# EAGLE design harp expander servo driver v1.1 (EAGLE 9.6.2)
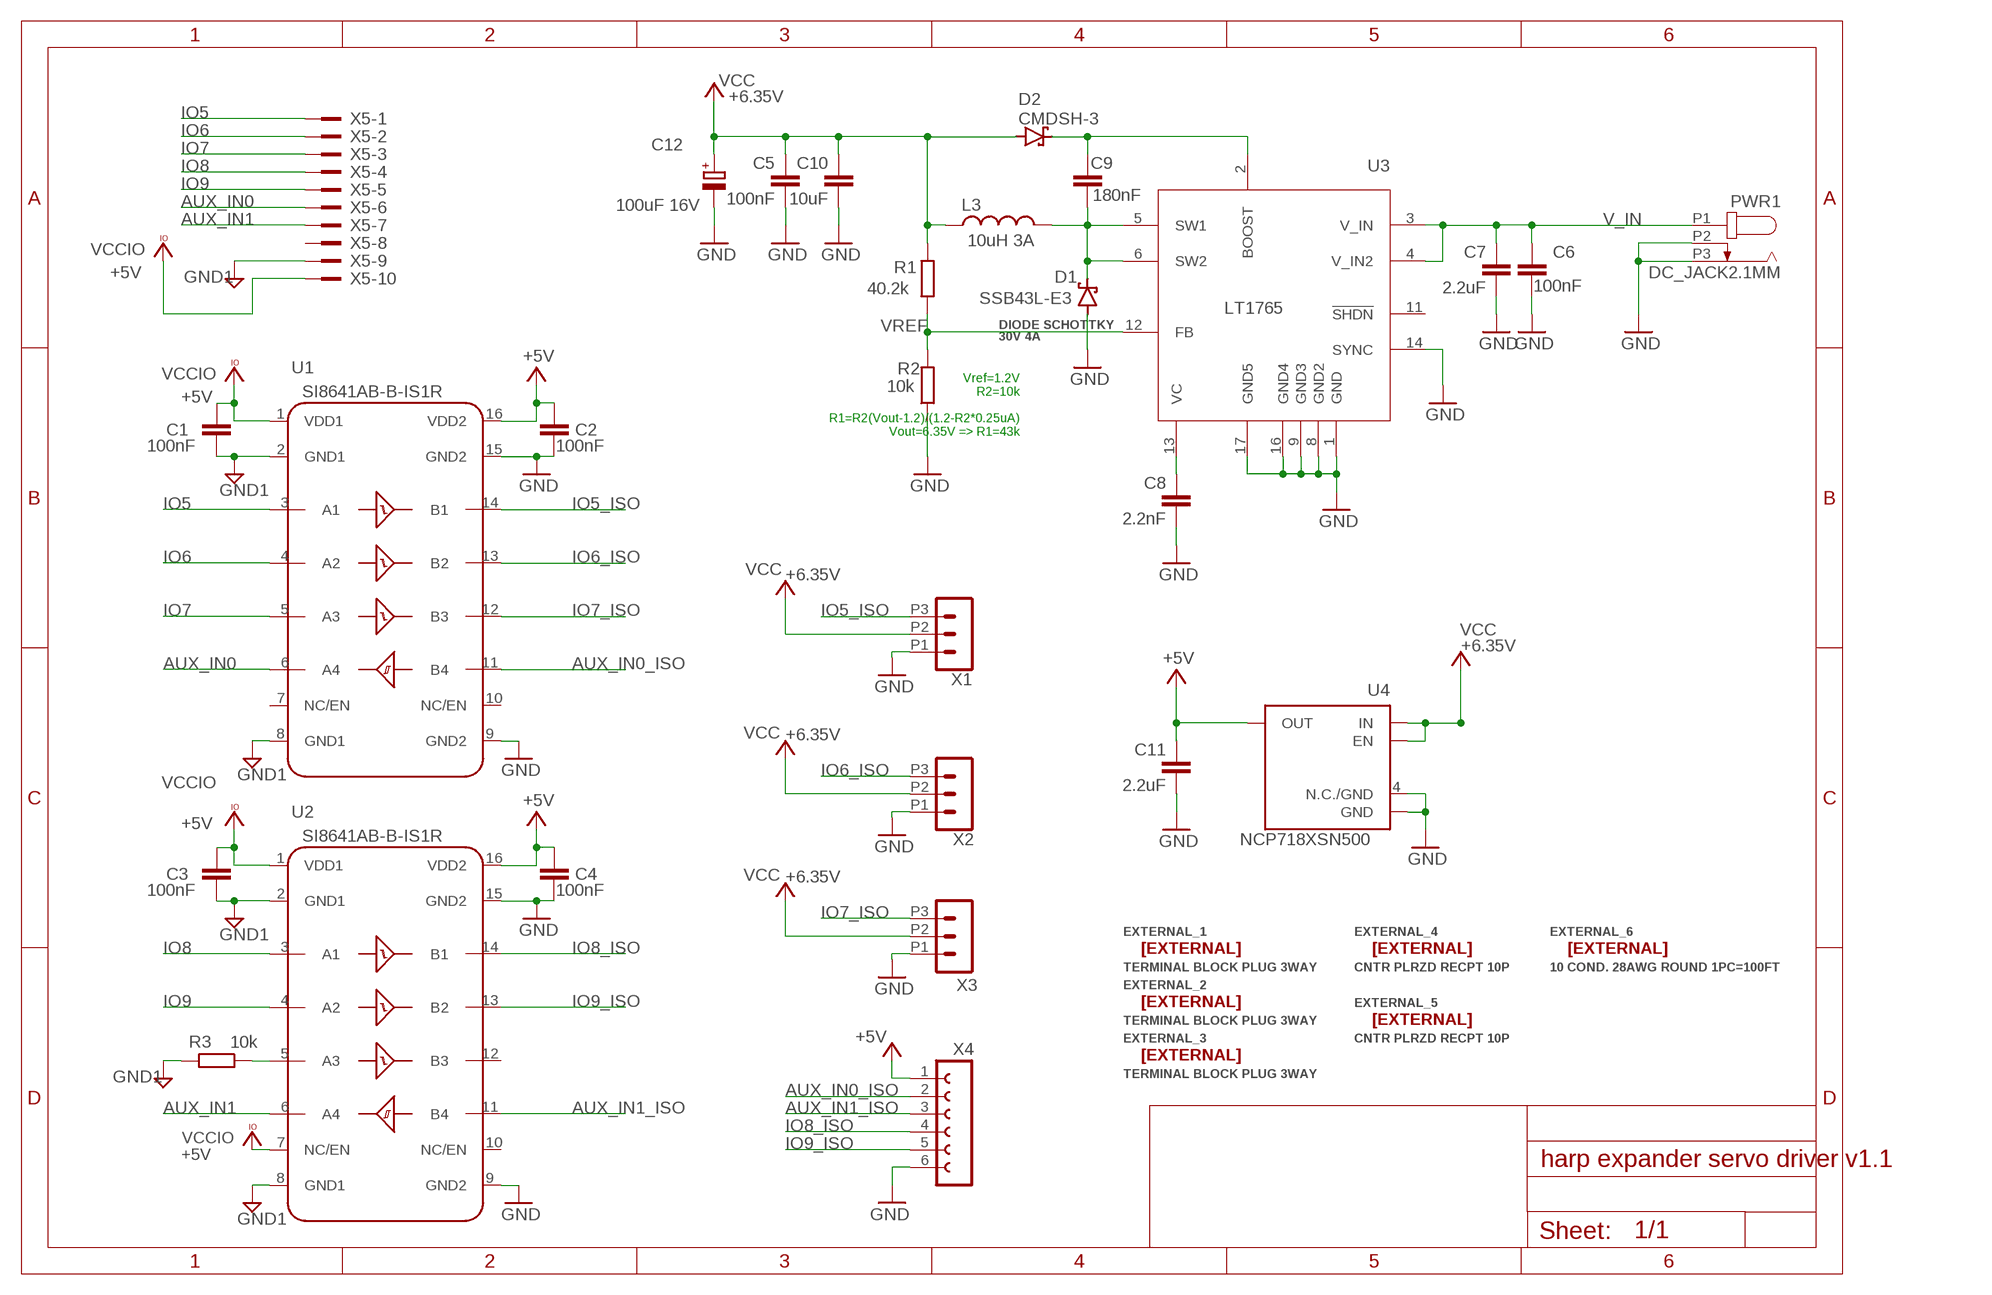
[diagram p0: schematic, sheet 1]

## Parts
C1  100nF  C-EUC0402  [C0402]
C2  100nF  C-EUC0402  [C0402]
C3  100nF  C-EUC0402  [C0402]
C4  100nF  C-EUC0402  [C0402]
C5  100nF  C-EUC0402  [C0402]
C6  100nF  C-EUC0402  [C0402]
C7  2.2uF  C-EUC0603  [C0603]
C8  2.2nF  C-EUC0402  [C0402]
C9  180nF  C-EUC0603  [C0603]
C10  10uF  C-EUC0603  [C0603]
C11  2.2uF  C-EUC0603  [C0603]
C12  100uF 16V  CPOL-EUCT7343  [CT7343]
D1  SSB43L-E3  MBRS130LT3  [SMB]
D2  CMDSH-3  SCHOTTKY-DIODESOD323  [SOD323-R]
EXTERNAL_1  TERMINAL BLOCK PLUG 3WAY  EXTERNAL  [-]
EXTERNAL_2  TERMINAL BLOCK PLUG 3WAY  EXTERNAL  [-]
EXTERNAL_3  TERMINAL BLOCK PLUG 3WAY  EXTERNAL  [-]
EXTERNAL_4  CNTR PLRZD RECPT 10P  EXTERNAL  [-]
EXTERNAL_5  CNTR PLRZD RECPT 10P  EXTERNAL  [-]
EXTERNAL_6  10 COND. 28AWG ROUND 1PC=100FT  EXTERNAL  [-]
L3  10uH 3A  L_IHLP2525CZER100M01  [L_IHLP_PADS]
PWR1  DC_JACK2.1MM  [DC_POWER_INPUT_2.1MM]
R1  40.2k  R-EU_R0402  [R0402]
R2  10k  R-EU_R0402  [R0402]
R3  10k  R-EU_R0402  [R0402]
U1  SI8641AB-B-IS1R  SI8641ABW  [SO16W]
U2  SI8641AB-B-IS1R  SI8641ABW  [SO16W]
U3  LT1765  [TSSOP16]
U4  NCP718XSN500  [SOT23-5]
X1  CON_3.5MM_1X3  [CON_3.5MM_1X3]
X2  CON_3.5MM_1X3  [CON_3.5MM_1X3]
X3  CON_3.5MM_1X3  [CON_3.5MM_1X3]
X4  aux_header  FE06-1  [FE06]
X5  IDC 10WAY STRAIGHT  2510-  [PAK100/2500-10]

## Nets
+5V: C2.1 C4.1 C11.1 U1.16(VDD2) U2.16(VDD2) U4.5(OUT) X4.1
AUX_IN0: U1.6(A4) X5.6
AUX_IN0_ISO: U1.11(B4) X4.2
AUX_IN1: U2.6(A4) X5.7
AUX_IN1_ISO: U2.11(B4) X4.3
GND: C2.2 C4.2 C5.2 C6.2 C7.2 C8.2 C10.2 C11.2 C12.- D1.A PWR1.P2 PWR1.P3 R2.1 U1.9(GND2) U1.15(GND2) U2.9(GND2) U2.15(GND2) U3.1(GND) U3.8(GND2) U3.9(GND3) U3.14(SYNC) U3.16(GND4) U3.17(GND5) U4.2(GND) U4.4(N.C./GND) X1.P1 X2.P1 X3.P1 X4.6
GND1: C1.2 C3.2 R3.2 U1.2(GND1) U1.8(GND1) U2.2(GND1) U2.8(GND1) X5.9
IO5: U1.3(A1) X5.1
IO5_ISO: U1.14(B1) X1.P3
IO6: U1.4(A2) X5.2
IO6_ISO: U1.13(B2) X2.P3
IO7: U1.5(A3) X5.3
IO7_ISO: U1.12(B3) X3.P3
IO8: U2.3(A1) X5.4
IO8_ISO: U2.14(B1) X4.4
IO9: U2.4(A2) X5.5
IO9_ISO: U2.13(B2) X4.5
N$9: R3.1 U2.5(A3)
N$10: C8.1 U3.13(VC)
N$17: C9.2 D1.C L3.2 U3.5(SW1) U3.6(SW2)
N$19: C9.1 D2.C U3.2(BOOST)
V_IN: C6.1 C7.1 PWR1.P1 U3.3(V_IN) U3.4(V_IN2)
VCC: C5.1 C10.1 C12.+ D2.A L3.1 R1.2 U4.1(IN) U4.3(EN) X1.P2 X2.P2 X3.P2
VCCIO: C1.1 C3.1 U1.1(VDD1) U2.1(VDD1) U2.7(NC/EN) X5.10
VREF: R1.1 R2.2 U3.12(FB)
Unconnected: U1.7(NC/EN) U1.10(NC/EN) U2.10(NC/EN) U2.12(B3) U3.7(NC7) U3.10(NC10) U3.11(!SHDN) U3.15(NC15) X5.8

## Notes on the sheet
- DIODE SCHOTTKY 
  30V 4A
- Vref=1.2V
  R2=10k
  
  R1=R2(Vout-1.2)/(1.2-R2*0.25uA)
  Vout=6.35V => R1=43k

## Library data of the parts
C1-C6 = rcl:C-EU: CAPACITOR, European symbol; DIGIKEY_PN: 445-6899-2-ND; MPN: CGA2B3X7R1H104K050BB; TYPE: SMD
C7 C11 = rcl:C-EU: CAPACITOR, European symbol; DIGIKEY_PN: 490-12738-1-ND; MPN: GRM188R61E225MA12D; TYPE: SMD
C8 = rcl:C-EU: CAPACITOR, European symbol; DIGIKEY_PN: 1276-1532-6-ND; MPN: CL05B222JB5NNNC; TYPE: SMD
C9 = rcl:C-EU: CAPACITOR, European symbol; DIGIKEY_PN: 490-GCG188R91H184KA01DCT-ND; MPN: GCG188R91H184KA01D; TYPE: SMD
C10 = rcl:C-EU: CAPACITOR, European symbol; DIGIKEY_PN: 587-3238-1-ND; MPN: EMK107BBJ106MA-T; TYPE: SMD
C12 = rcl:CPOL-EU: POLARIZED CAPACITOR, European symbol; DIGIKEY_PN: 399-18066-1-ND; MPN: T491D107K016AT7280; SPICEPREFIX: C; TYPE: SMD
D1 = diode:MBRS130LT3: Schottky Power Rectifier Source: http://www.onsemi.com/pub/Collateral/MBRS130LT3-D.PDF; DIGIKEY_PN: SSB43L-E3/52TGICT-ND; MPN: SSB43L-E3/52T; TYPE: SMD
D2 = harp expander servo driver v1.0:SCHOTTKY-DIODE: Schottky Diode; DIGIKEY_PN: 1514-CMDSH-3TRPBFREECT-ND; MPN: CMDSH-3; TYPE: SMD
EXTERNAL_1-EXTERNAL_3 = harp expander servo driver v1.0:EXTERNAL: external component; DIGIKEY_PN: 732-2752-ND; MPN: 691361100003; TYPE: -
EXTERNAL_4 EXTERNAL_5 = harp expander servo driver v1.0:EXTERNAL: external component; DIGIKEY_PN: AKC10H-ND; MPN: 1658621-1; TYPE: -
EXTERNAL_6 = harp expander servo driver v1.0:EXTERNAL: external component; DIGIKEY_PN: 3M157849-100-ND; MPN: 3365/10 100; TYPE: -
L3 = harp expander servo driver v1.0:L_IHLP2525CZER100M01: symbol description; DIGIKEY_PN: 541-1013-2-ND; MOUSER_PN: 70-IHLP2525CZER100M0; MPN: IHLP2525CZER100M01; TYPE: SMD
PWR1 = harp expander servo driver v1.0:DC_JACK; DIGIKEY_PN: 163-179PH-EX MOUSER; MPN: 163-179PH-EX; TYPE: TH
R1 = rcl:R-EU_: RESISTOR, European symbol; DIGIKEY_PN: 311-40.2KLRCT-ND; MPN: RC0402FR-0740K2L; TYPE: SMD
R2 R3 = rcl:R-EU_: RESISTOR, European symbol; DIGIKEY_PN: 541-3959-1-ND; MPN: CRCW040210K0FKEDC; TYPE: SMD
U1 U2 = harp expander servo driver v1.0:SI8641AB; DIGIKEY_PN: SI8641AB-B-IS-ND; MOUSER_PN: 634-SI8641AB-B-IS1R; MPN: SI8641AB-B-IS1R; TYPE: SMD
U3 = harp expander servo driver v1.0:LT1765; DIGIKEY_PN: LT1765EFE#TRPBFCT-ND; MPN: LT1765EFE#TRPBF; TYPE: SMD
U4 = harp expander servo driver v1.0:NCP718XSN500; DIGIKEY_PN: NCP718BSN500T1GOSCT-ND; MPN: NCP718BSN500T1G; TYPE: SMD
X1-X3 = harp expander servo driver v1.0:CON_3.5MM_1X3; DIGIKEY_PN: 732-2770-ND; MPN: 691322110003; TYPE: TH
X4 = con-lsta:FE06-1: FEMALE HEADER; MPN: n.a.; OC_FARNELL: unknown; OC_NEWARK: unknown; TYPE: n.a.
X5 = con-3m:2510-: 3M (TM) Pak 100 4-Wall Header Source: 3M; DIGIKEY_PN: S9169-ND; MF: -; MPN: SBH11-PBPC-D05-ST-BK; OC_FARNELL: -; OC_NEWARK: -; TYPE: TH

## Board
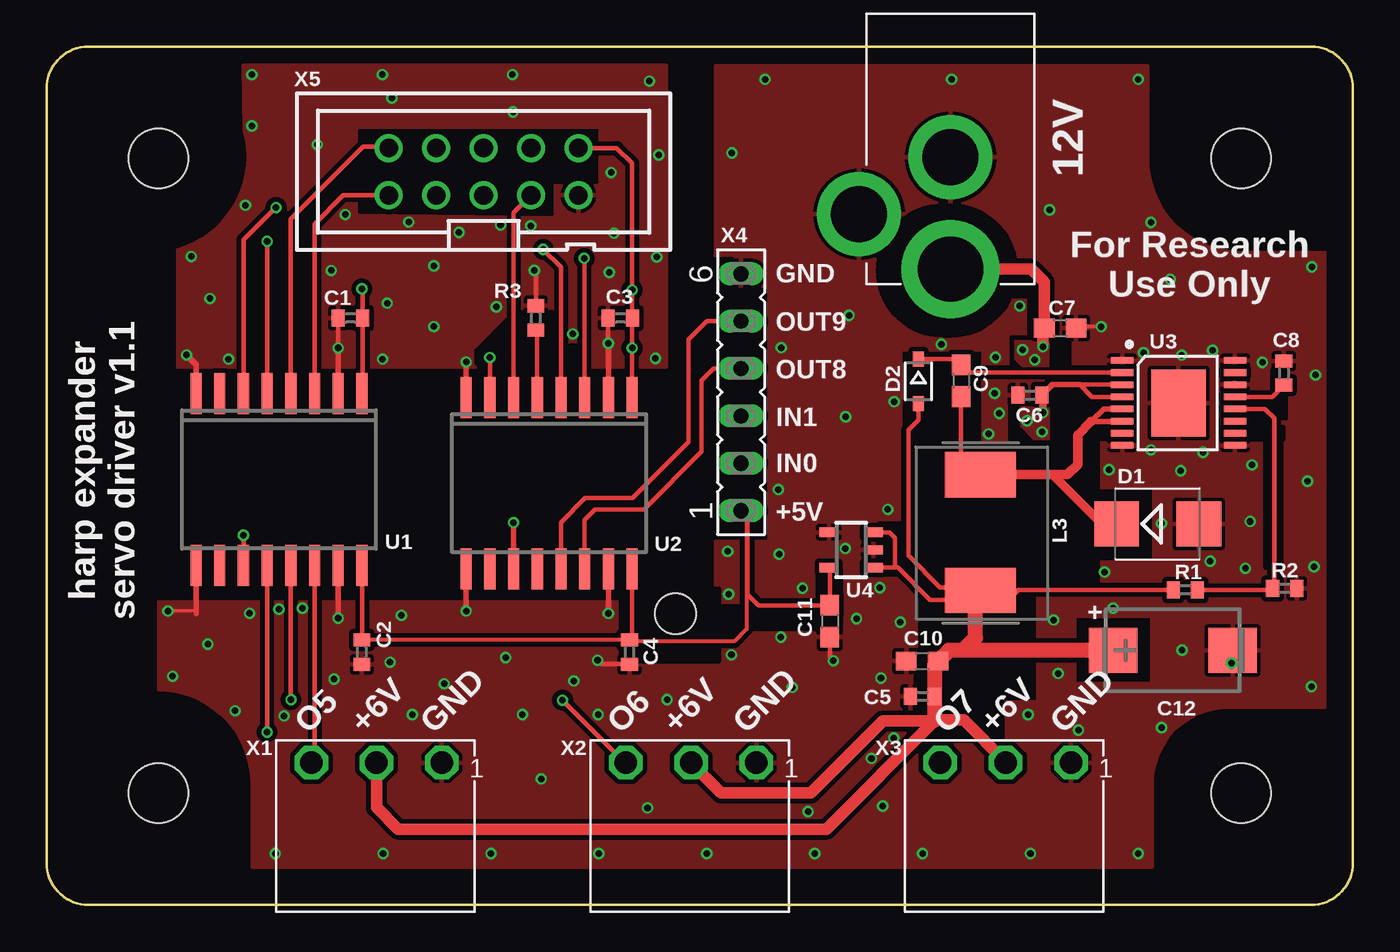
[diagram p1: board, top side]
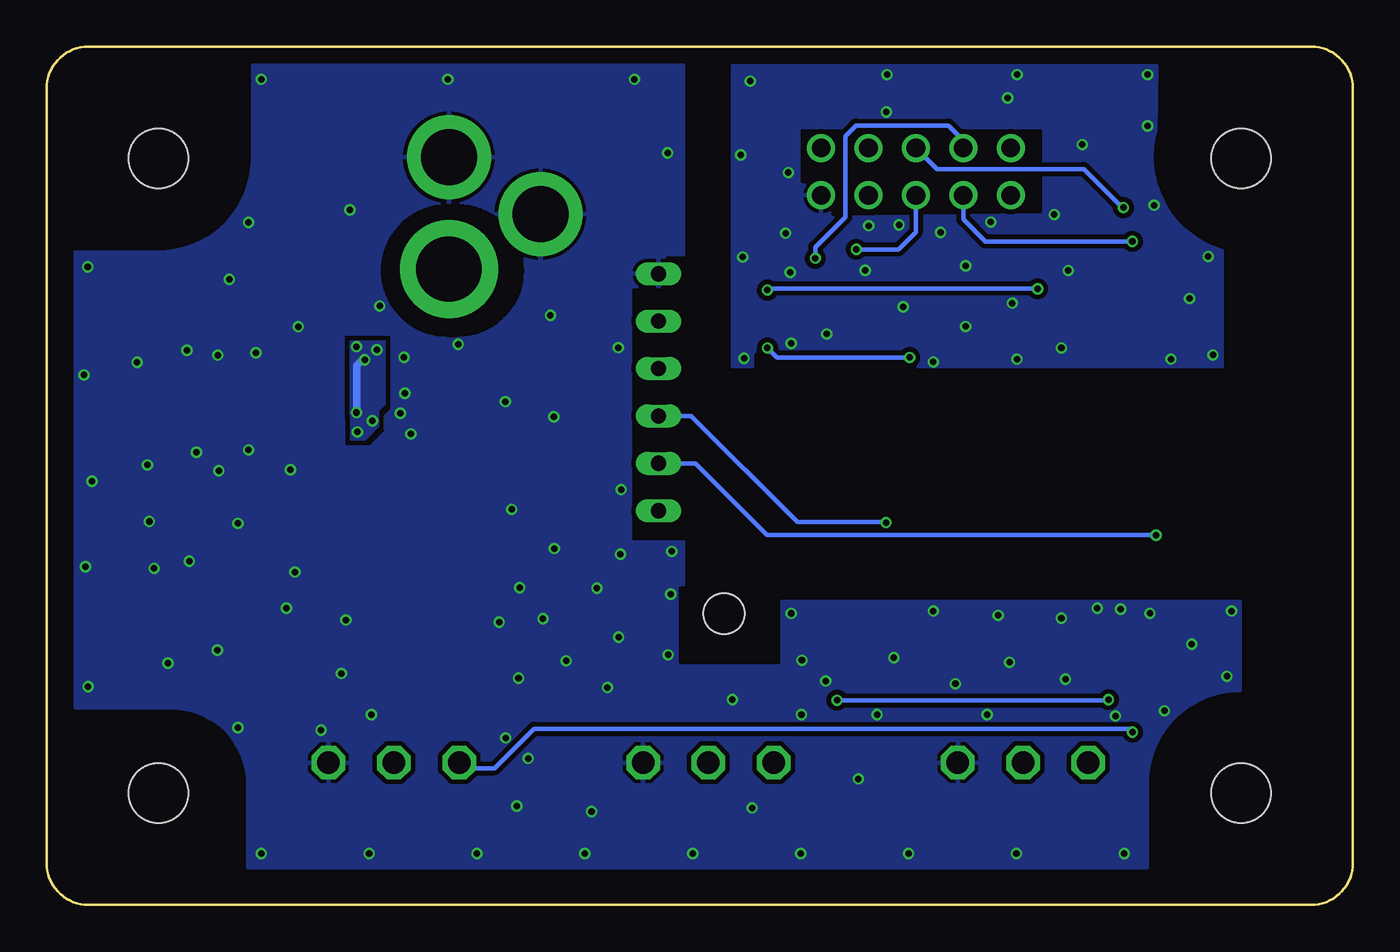
[diagram p2: board, bottom side, seen from below]

Size 70 x 46 mm. Coordinates in mm from the lower left corner, seen from the top.
Outline: 67.76,46 2.24,46 arc90 0,43.76 0,2.24 arc90 2.24,0 67.76,0 arc90 70,2.24 70,43.76 arc90 67.76,46
Copper layers (1*16): Top 0.018mm / dielectric 1.55mm / Bottom 0.018mm
Design rules "eC_2Layer_PClass6_BaseCopperO18_eCDefault *": minimum track width 6mil, minimum drill 0.35mm, track to track 6mil, track to pad 6mil, pad to pad 6mil, via to via 6mil, smd to smd 0mil, copper to edge 0.25mm, drill to drill 0.35mm, minimum pad ring 0.175mm, minimum via ring 0.125mm, stop-mask expansion 0mil, vias tented up to drill 0.45mm, thermal gap 0.2mm
Holes 3.2 mm at 6,40 6,6 64,6 64,40
Holes 2.2 mm at 33.71,15.61

### Footprints (pad centres in the part's own frame; a part is rotated, then mirrored left to right if it is on the bottom)
C0402 = smd 0.7 x 0.9: 1 -0.65,0; 2 0.65,0
C0603 = smd 1.1 x 1: 1 -0.85,0; 2 0.85,0
CT7343 = smd 2.6 x 2.4: + -3.2,0; - 3.2,0
SMB = smd 2.4 x 2.4: A 2.2,0; C -2.2,0
SOD323-R = smd 0.8 x 0.6: A 1.2,0; C -1.2,0
L_IHLP_PADS = smd 2.413 x 3.81: 1 -3.1,0; 2 3.1,0
DC_POWER_INPUT_2.1MM = drill 3.5: P1 8.5,0 | drill 3: P2 2.5,0; P3 5.55,-4.9
R0402 = smd 0.7 x 0.9: 1 -0.65,0; 2 0.65,0
SO16W = smd 0.6 x 2.2: 1 -4.445,-4.6; 2 -3.175,-4.6; 3 -1.905,-4.6; 4 -0.635,-4.6; 5 0.635,-4.6; 6 1.905,-4.6; 7 3.175,-4.6; 8 4.445,-4.6; 9 4.445,4.6; 10 3.175,4.6; 11 1.905,4.6; 12 0.635,4.6; 13 -0.635,4.6; 14 -1.905,4.6; 15 -3.175,4.6; 16 -4.445,4.6
TSSOP16 = smd 0.35 x 1.2: 1 -2.159,-2.897; 2 -1.504,-2.897; 3 -0.854,-2.897; 4 -0.204,-2.897; 5 0.446,-2.897; 6 1.096,-2.897; 7 1.746,-2.897; 8 2.396,-2.897; 9 2.396,3.148; 10 1.746,3.148; 11 1.096,3.148; 12 0.446,3.148; 13 -0.204,3.148; 14 -0.854,3.148; 15 -1.504,3.148; 16 -2.154,3.148 | smd 3.58 x 2.9: 17 0.121,0.126
SOT23-5 = smd 0.5 x 1: 1 -0.95,-1.2; 2 0,-1.2; 3 0.95,-1.2; 4 0.95,1.2; 5 -0.95,1.2
CON_3.5MM_1X3 = drill 1.2 octagon: P1 -3.5,0; P2 0,0; P3 3.5,0
FE06 = drill 0.813 long: 1 -6.35,0; 2 -3.81,0; 3 -1.27,0; 4 1.27,0; 5 3.81,0; 6 6.35,0
PAK100/2500-10 = drill 1 pad 1.422: 1 -5.08,-1.27; 2 -5.08,1.27; 3 -2.54,-1.27; 4 -2.54,1.27; 5 0,-1.27; 6 0,1.27; 7 2.54,-1.27; 8 2.54,1.27; 9 5.08,-1.27; 10 5.08,1.27

### Placement (x,y rotation side)
C1  16.28,31.46 180 top
C2  16.89,13.54 270 top
C3  30.74,31.46 180 top
C4  31.24,13.54 270 top
C5  46.94,11.17 180 top
C6  52.69,27.32 180 top
C7  54.32,30.92 0 top
C8  66.3,28.5 90 top
C9  49,28.1 270 top
C10  46.92,13.07 180 top
C11  41.97,15.2 270 top
C12  60.36,13.65 0 top
D1  59.54,20.42 0 top
D2  46.72,28.06 270 top
EXTERNAL_1  3.25,0.81 0 top
EXTERNAL_2  3.25,0.81 0 top
EXTERNAL_3  3.25,0.81 0 top
EXTERNAL_4  3.25,0.81 0 top
EXTERNAL_5  3.25,0.81 0 top
EXTERNAL_6  3.25,0.81 0 top
L3  50.05,19.95 90 top
PWR1  48.44,42.57 270 top
R1  61.02,16.88 180 top
R2  66.35,16.97 180 top
R3  26.22,31.46 90 top
U1  12.45,22.8 180 top
U2  26.93,22.6 180 top
U3  60.53,27.03 270 top
U4  43.11,19.02 90 top
X1  17.68,7.62 180 top
X2  34.54,7.62 180 top
X3  51.39,7.62 180 top
X4  37.21,27.48 90 top
X5  23.42,39.3 0 top

### Tracks (layer width: path | path; a pad name or v marks a point on that pad's centre or on a via)
+5V
  Top 0.203: X4.1 37.51,20.83 37.51,14.78 36.86,14.12 31.31,14.12 C4.1 17.02,14.19 C2.1
  Top 0.254: X4.1 37.56,20.78 37.56,16.63 38.14,16.05 C11.1 41.97,18.02 arc-90 U4.5 | U2.16 31.37,14.32 C4.1 | U1.16 16.9,14.31 17.02,14.19
AUX_IN0  (via drill 0.35)
  Top 0.254: v12.3,37.38 12.27,37.38 10.55,35.65 U1.6
  Bottom 0.254: X5.6 22.29,39.44 14.42,39.44 12.36,37.38 v12.3,37.38
AUX_IN0_ISO  (via drill 0.35)
  Top 0.254: U1.11 v10.55,19.81 v10.54,19.81
  Bottom 0.254: X4.2 35.23,23.67 31.4,19.83 10.56,19.83 v10.54,19.81
AUX_IN1
  Top 0.254: U2.6 25.02,37.09 X5.7
AUX_IN1_ISO  (via drill 0.35)
  Top 0.305: v25.02,20.49 U2.11
  Bottom 0.254: X4.3 35.46,26.21 29.77,20.52 25.04,20.52 v25.02,20.49
GND  (via drill 0.35)
  Top 0.152: 8.01,15.63 8.01,15.75 v6.5,15.75 | C7.2 55.24,30.99
  Top 0.203: v56.52,30.99 55.24,30.99
  Top 0.254: C11.2 41.97,13.28 v42.16,13.08 | C4.2 31.23,12.9 29.72,12.9 v29.52,13.1
  Top 0.305: U1.9 8.01,15.63 | U2.9 v22.48,15.75 | U1.15 v15.63,15.37 v15.62,15.37 | U2.15 v30.1,15.63 v30.1,15.62
  other vias: 60.22,33.53 65.15,29.08 6.75,12.25 12.25,2.75 18.03,2.75 10.1,10.4 23.81,2.75 29.59,2.75 35.38,2.75 41.16,2.75 46.94,2.75 52.72,2.75 58.5,2.75 67.78,11.7 67.8,34.2 59.75,9.5 38.5,44.25 48.5,44.25 58.5,44.25 36.72,40.3 53.75,37.25 19,15.52 12.72,10.12 10.88,15.63 21.3,11.85 28.25,12 33.25,11 26.5,6.75 19.6,10.2 29.55,10.2 25.5,10.2 44.8,5.3 39.21,22.26 44.71,12.15 58.78,29.59 62.48,29.72 60.83,29.46 60.78,23.27 59.18,24.38 61.98,24.26 64.59,23.58 56.94,23.32 62.36,18.41 64.24,18.04 53.96,15.27 56.7,17.84 54.2,12.4 63.5,12.95 67.92,18.12 67.57,22.71 59.18,36.58 55.3,9.37 50.8,27.42 45.42,26.97 50.48,25.24 45.08,21.2 39.37,29.86 8.64,13.97 43.4,15.34 45.75,15.15 39.35,14.35 39.95,11.65 40.51,16.97 42.82,26.16 51.05,26.35 59.75,20.45 64.5,20.55 52.15,32.1 50.85,29.35 43,31.6 60.85,13.65 57.15,15.9 68,28.4 42.8,19.1 24.6,13.25 18.4,13 15.4,12.1 47.95,30.05 39.25,18.8 36.5,18.95 36.7,13.4 36.55,16.65 44.65,17 13.7,15.9 12.45,15.85 40.8,5 32.2,5.2 44.2,7.85 45.4,8.95 52.6,10.2
  pour Top (isolate 0.254, rank 6): 6,16.26 35.84,16.26 35.84,45 59,45 59,40 arc90 64,35 68.5,35 68.5,10.56 63.31,10.56 arc90 59.25,6.5 59.25,2 11,2 11,6.5 arc90 6,11.5
  pour Bottom (isolate 0.254, rank 6): 6,16.26 35.84,16.26 35.84,45 59,45 59,40 arc90 64,35 68.5,35 68.5,10.56 63.31,10.56 arc90 59.25,6.5 59.25,2 11,2 11,6.5 arc90 6,11.5
GND1  (via drill 0.35)
  Top 0.254: C1.2 15.63,29.86 v15.62,29.84 | v30.1,30.1 30.09,30.11 C3.2 | R3.2 26.21,33.93 v26.14,34.01
  Top 0.305: U1.8 8.01,28.97 v7.5,29.47 | U2.8 v22.48,29.09 v22.48,29.1 | U2.2 v30.1,30.09 30.09,30.11 | U1.2 v15.63,29.84 v15.62,29.84
  other vias: 32.62,29.3 7.75,34.75 10.66,37.5 11,44.5 11,41.75 17.99,44.5 24.96,44.5 32.3,44.15 32.8,40.2 32.7,34.73 16,37 15.25,34 18,29.25 30.15,33.9 24.1,32.05 18.25,32.25 20.75,34.25 20.75,31 9.75,29.25 8.75,32.5 14.5,40.75 25.95,36.4 24.32,36.45 22.1,36.05 25,42.5 18.5,43.25 30.25,39.25 28.2,30.6 30.4,36 19.4,36.6
  pour Bottom (isolate 0.254): 33.26,45 10.5,45 10.57,41.5 arc-90 6.99,35.1 6.99,28.83 33.26,28.83
  pour Top (isolate 0.254): 33.26,45 10.5,45 10.57,41.5 arc-90 6.99,35.1 6.99,28.83 33.26,28.83
IO5
  Top 0.254: U1.3 14.36,30.73 14.35,30.73 14.35,36.5 15.88,38.03 X5.1
IO5_ISO
  Top 0.254: U1.14 14.36,10.44 14.36,7.8 X1.P3
IO6
  Top 0.254: U1.4 13.09,30.09 13.08,30.1 13.08,36.75 16.97,40.64 18.34,40.64 X5.2
IO6_ISO  (via drill 0.35)
  Top 0.254: U1.13 13.08,18.19 13.08,11.02 v13.1,10.99 | X2.P3 30.99,7.62 v27.65,10.97
  Bottom 0.254: v27.65,10.97 13.12,10.97 v13.1,10.99
IO7  (via drill 0.35)
  Top 0.254: U1.5 v11.82,35.56
  Bottom 0.254: v11.82,35.56 19.69,35.56 20.88,36.75 X5.3
IO7_ISO  (via drill 0.35)
  Top 0.254: v11.81,9.26 v11.82,9.26 U1.12
  Bottom 0.254: X3.P3 47.59,7.32 45.99,7.32 43.87,9.45 12,9.45 v11.81,9.26
IO8  (via drill 0.35)
  Top 0.254: U2.3 28.83,34.66 v28.8,34.66
  Bottom 0.254: v28.8,34.66 28.8,35.26 27.2,36.87 27.2,41.2 26.63,41.77 21.68,41.77 20.88,40.97 X5.4
IO8_ISO
  Top 0.254: X4.4 35.75,28.75 35.1,28.1 35.1,24.3 32,21.2 29.4,21.2 28.83,20.63 U2.14
IO9  (via drill 0.35)
  Top 0.254: v26.61,35.13 27.56,34.18 U2.4
  Bottom 0.254: X5.5 23.42,36.07 24.36,35.13 v26.61,35.13
IO9_ISO
  Top 0.254: U2.13 27.56,20.5 28.86,21.8 31.4,21.8 34.4,24.8 34.4,30.3 35.39,31.29 X4.5
N$1
  cutout Top: 2.5,40 arc-90 6,43.5 arc-90 9.5,40 arc-90 6,36.5 arc-90
N$2
  cutout Top: 27.77,28.86 27.77,30.06 28.7,30.06 28.7,28.86
N$3
  cutout Top: 2.5,6 arc-90 6,9.5 arc-90 9.5,6 arc-90 6,2.5 arc-90
N$4
  cutout Top: 60.5,40 arc-90 64,43.5 arc-90 67.5,40 arc-90 64,36.5 arc-90
N$5
  cutout Top: 60.5,6 arc-90 64,9.5 arc-90 67.5,6 arc-90 64,2.5 arc-90
N$6
  cutout Bottom: 60.5,40 arc-90 64,43.5 arc-90 67.5,40 arc-90 64,36.5 arc-90
N$7
  cutout Bottom: 60.5,6 arc-90 64,9.5 arc-90 67.5,6 arc-90 64,2.5 arc-90
N$8
  cutout Bottom: 2.5,6 arc-90 6,9.5 arc-90 9.5,6 arc-90 6,2.5 arc-90
N$9
  Top 0.254: U2.5 26.29,30.73 R3.1
N$10
  Top 0.254: U3.13 65.68,27.23 C8.1
N$11
  cutout Bottom: 2.5,40 arc-90 6,43.5 arc-90 9.5,40 arc-90 6,36.5 arc-90
N$12
  cutout Bottom: 35.73,32.99 38.56,32.99 38.56,19.6 35.73,19.6
N$13
  cutout Top: 35.75,33.01 38.56,33.01 38.56,19.65 35.75,19.65
N$14
  cutout Top: 46.54,13.21 51.27,13.21 51.27,8.7 46.54,8.7
N$15
  cutout Bottom: 35.56,34.68 36.76,34.68 36.76,32.3 35.56,32.3
N$16
  cutout Top: 55.12,25.65 57.18,25.65 57.18,24.89 55.12,24.89
N$17
  Top 0.254: C9.2 49,23.93 L3.2
  Top 0.305: U3.5 56.64,26.58 55.97,25.91 57.62,25.91 U3.6
  Top 0.508: D1.C 56.54,20.42 53.91,23.05 | 55.97,25.91 55.25,25.19 55.25,23.6 54.7,23.05 53.91,23.05 | L3.2 53.91,23.05
N$18
  cutout Top: 62.74,25.65 66.29,25.65 66.29,24.89 62.74,24.89
N$19
  Top 0.254: D2.C 49.16,29.26 C9.1 49.41,28.53 U3.2
N$20
  cutout Top: 54.36,30.48 54.86,30.48 54.86,28.7 54.36,28.7
N$21
  cutout Top: 44.58,20.52 47.75,20.52 47.75,17.64 44.58,17.64
N$22
  cutout Top: 45.93,19.99 45.93,29.61 50.03,29.61 50.03,19.99
N$25
  cutout Bottom: 29.5,38.75 29.5,41.5 16.75,41.5 16.75,37.12 27.88,37 27.88,38.75
N$26
  cutout Top: 24.9,31.82 27.25,31.82 27.25,30.5 24.9,30.5
N$27
  cutout Top: 29.5,38.75 29.5,41.5 16.75,41.5 16.75,37.12 27.1,37 27.1,38.75
N$28
  cutout Bottom: 32,28.5 32,29.5 31.5,30 30.75,29.25 30.75,28.75 31,28.5
N$29
  cutout Top: 24.75,28.75 23.25,28.75 23,29 23,29.75 24.75,31.5
N$30
  cutout Bottom: 30.75,17 36.05,17 36.05,13 30.75,13
N$31
  cutout Top: 30.75,17 36.05,17 36.05,13 30.75,13
N$33
  cutout Top: 56.38,16.76 47.5,16.76 47.5,24.79 56.38,24.79
N$34
  cutout Top: 65.28,18.03 65.28,24.89 66.19,24.89 66.19,18.03
N$35
  cutout Top: 65.66,26.04 65.66,28.7 66.42,28.7 66.42,26.04
N$36
  cutout Top: 46.76,11.03 46.76,17.18 52.95,17.18 52.95,11.03
N$37
  cutout Top: 51.61,26.73 52.11,26.73 52.11,24.65 51.61,24.65
N$38
  cutout Top: 55.76,22.23 59.16,22.23 59.16,18.5 55.76,18.5
N$39
  cutout Top: 52.61,33.68 53.21,33.68 53.21,30.45 52.61,30.45
N$40
  cutout Top: 48.5,37.5 48,37.5 arc90 44.5,34 arc90 48,30.5 48.5,30.5 arc90 52,34 arc90
N$41
  cutout Bottom: 48.5,37.5 48,37.5 arc90 44.5,34 arc90 48,30.5 48.5,30.5 arc90 52,34 arc90
N$42
  cutout Top: 51.52,32.56 51.52,33.06 52.8,33.06 52.8,32.56
N$43
  cutout Top: 55.26,15.33 59.06,15.33 59.06,12 55.26,12
N$44
  cutout Top: 41.26,17.98 42.61,17.98 42.61,14.65 41.26,14.65
N$45
  cutout Top: 30.37,30.86 30.37,32.06 31.9,32.06 31.9,30.86
N$46
  cutout Top: 15.92,30.86 15.92,32.06 17.45,32.06 17.45,30.86
N$47
  cutout Top: 35.56,34.68 36.76,34.68 36.76,32.3 35.56,32.3
N$48
  cutout Top: 35.74,16.05 41.54,16.05 41.54,14.74 35.74,14.74
V_IN  (via drill 0.35)
  Top 0.152: C6.1 53.39,27.27
  Top 0.254: U3.3 55.37,27.88 56.02,27.23 U3.4 | C7.1 53.39,30.84
  Top 0.305: C6.1 53.9,27.88 55.37,27.88
  Top 0.406: 53.39,27.27 v53.39,26.39
  Top 0.61: PWR1.P1 52.76,34.07 53.47,33.37 C7.1 | 53.39,30.84 v53.39,29.92
  Bottom 0.406: v52.95,29.21 53.09,29.21 53.39,28.91 v53.39,26.39
  other vias: 53.35,25.35 52.3,29.75 52.55,25.95
  pour Bottom: 53.72,24.95 52.91,24.95 52.2,25.65 52.2,26.67 53.72,26.67
  pour Top: 53.72,24.95 52.91,24.95 52.2,25.65 52.2,26.67 53.72,26.67
  pour Top: 53.72,28.7 53.72,30.23 51.9,30.23 51.9,29.26 52.45,28.7
  pour Bottom: 53.72,26.26 53.72,30.23 51.9,30.23 51.9,26.82 52.45,26.26
VCC
  Top 0.203: 45.47,18.07
  Top 0.254: U4.1 45.47,18.07 45.63,18.07 47.35,16.35 49.78,16.35 L3.1 | U4.3 45.16,19.97 45.47,19.66 45.47,18.07 | R1.2 52.07,16.88 51.54,16.35 L3.1 | L3.1 49.38,17.02 47.88,17.02 46.18,18.72 46.18,25.44 46.72,25.98 D2.A
  Top 0.61: C10.1 47.59,12.88 | X1.P2 17.68,5.22 18.84,4.06 41.79,4.06 47.59,9.86 | X3.P2 51.39,7.66 49.15,9.9 47.59,9.9 47.59,9.86 | X2.P2 36.15,6 40.95,6 44.8,9.86 47.59,9.86
  Top 0.813: C12.+ 49.11,13.65 | 49.11,13.65 48.35,13.65 C10.1 | 49.11,13.65 49.78,14.32 49.78,16.35 | 47.59,12.88 C5.1 47.59,9.9
VCCIO  (via drill 0.35)
  Top 0.254: U2.1 v31.37,29.84 31.37,31.44 | 31.37,31.44 C3.1 | U1.1 16.93,27.43 C1.1 16.93,32.98 v16.89,33.02 | X5.10 30.55,40.57 31.37,39.75 v31.37,32.95 31.37,31.44 | U2.7 v23.75,29.33 v23.75,29.34
  Bottom 0.254: v16.89,33.02 31.31,33.02 v31.37,32.95 | v23.75,29.34 30.87,29.34 v31.37,29.84
VREF
  Top 0.254: U3.12 65.29,26.58 65.79,26.08 65.79,17.44 R2.2 65.61,16.88 R1.1

### Text on the board
tPlace: 12V | GND | OUT9 | OUT8 | IN1 | IN0 | +5V | + | O5 | +6V | GND | O6 | +6V | GND | O7 | +6V | GND
tNames: For Research / Use Only | harp expander / servo driver v1.1